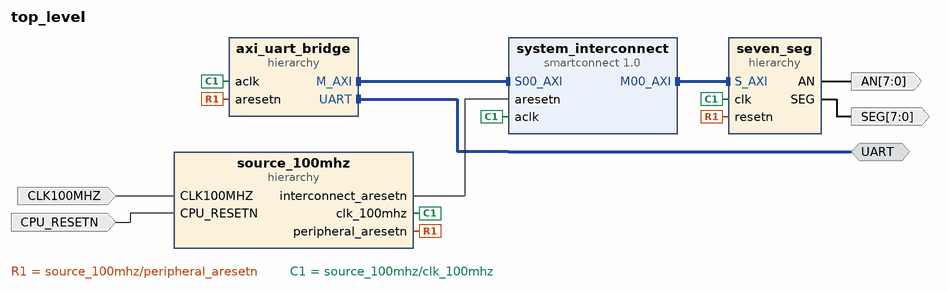
[diagram p0: block diagram of the top level]
# Vivado block design top_level, xc7a100tcsg324-1, Vivado 2021.1
create_bd_design top_level

create_bd_intf_port -mode Master -vlnv xilinx.com:interface:uart_rtl:1.0 UART
create_bd_port -dir I -type clk CLK100MHZ
set_property -dict {CONFIG.ASSOCIATED_RESET CPU_RESETN} [get_bd_ports CLK100MHZ]
create_bd_port -dir I -type rst CPU_RESETN
create_bd_port -dir O -from 7 -to 0 SEG
create_bd_port -dir O -from 7 -to 0 AN

create_bd_cell -type hier source_100mhz
create_bd_cell -type hier axi_uart_bridge
create_bd_cell -type hier seven_seg
create_bd_cell -type ip -vlnv xilinx.com:ip:smartconnect:1.0 system_interconnect
set_property -dict {CONFIG.NUM_SI 1} [get_bd_cells system_interconnect]

# ---- hierarchy /source_100mhz ----
current_bd_instance /source_100mhz
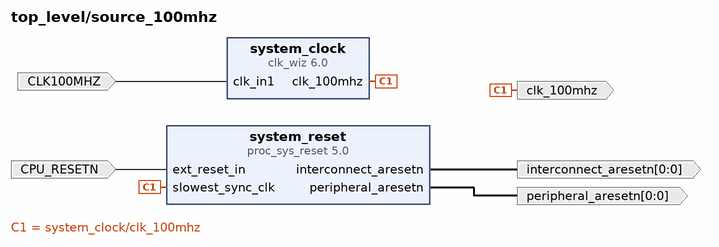
[diagram p1: block diagram inside /source_100mhz]
create_bd_pin -dir I -type clk CLK100MHZ
create_bd_pin -dir O -type clk clk_100mhz
create_bd_pin -dir I -type rst CPU_RESETN
create_bd_pin -dir O -from 0 -to 0 -type rst interconnect_aresetn
create_bd_pin -dir O -from 0 -to 0 -type rst peripheral_aresetn

create_bd_cell -type ip -vlnv xilinx.com:ip:clk_wiz:6.0 system_clock
set_property -dict [list \
  CONFIG.CLKOUT1_DRIVES BUFGCE \
  CONFIG.CLKOUT2_DRIVES BUFGCE \
  CONFIG.CLKOUT3_DRIVES BUFGCE \
  CONFIG.CLKOUT4_DRIVES BUFGCE \
  CONFIG.CLKOUT5_DRIVES BUFGCE \
  CONFIG.CLKOUT6_DRIVES BUFGCE \
  CONFIG.CLKOUT7_DRIVES BUFGCE \
  CONFIG.CLK_OUT1_PORT clk_100mhz \
  CONFIG.FEEDBACK_SOURCE FDBK_AUTO \
  CONFIG.USE_LOCKED false \
  CONFIG.USE_RESET false \
  CONFIG.USE_SAFE_CLOCK_STARTUP true \
] [get_bd_cells system_clock]
create_bd_cell -type ip -vlnv xilinx.com:ip:proc_sys_reset:5.0 system_reset

# ---- hierarchy /axi_uart_bridge ----
current_bd_instance /axi_uart_bridge
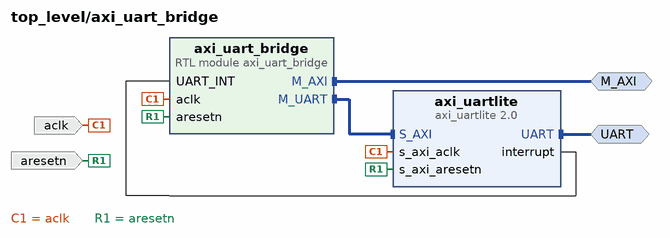
[diagram p2: block diagram inside /axi_uart_bridge]
create_bd_intf_pin -mode Master -vlnv xilinx.com:interface:aximm_rtl:1.0 M_AXI
create_bd_intf_pin -mode Master -vlnv xilinx.com:interface:uart_rtl:1.0 UART
create_bd_pin -dir I -type rst aresetn
create_bd_pin -dir I -type clk aclk

create_bd_cell -type module -reference axi_uart_bridge axi_uart_bridge
create_bd_cell -type ip -vlnv xilinx.com:ip:axi_uartlite:2.0 axi_uartlite
set_property -dict {CONFIG.C_BAUDRATE 115200} [get_bd_cells axi_uartlite]

# ---- hierarchy /seven_seg ----
current_bd_instance /seven_seg
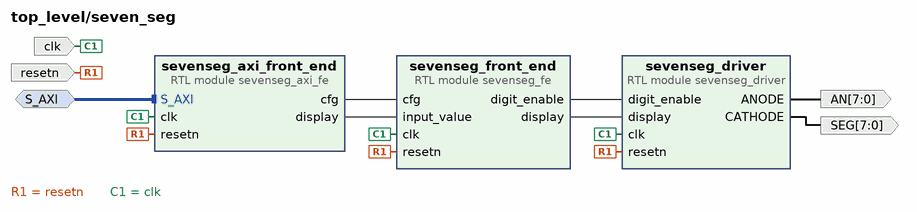
[diagram p3: block diagram inside /seven_seg]
create_bd_intf_pin -mode Slave -vlnv xilinx.com:interface:aximm_rtl:1.0 S_AXI
create_bd_pin -dir I -type clk clk
create_bd_pin -dir I -type rst resetn
create_bd_pin -dir O -from 7 -to 0 SEG
create_bd_pin -dir O -from 7 -to 0 AN

create_bd_cell -type module -reference sevenseg_driver sevenseg_driver
create_bd_cell -type module -reference sevenseg_axi_fe sevenseg_axi_front_end
create_bd_cell -type module -reference sevenseg_fe sevenseg_front_end

# ---- connections ----

current_bd_instance /source_100mhz
connect_bd_net [get_bd_pins CLK100MHZ] [get_bd_pins system_clock/clk_in1]
connect_bd_net [get_bd_pins CPU_RESETN] [get_bd_pins system_reset/ext_reset_in]
connect_bd_net [get_bd_pins system_clock/clk_100mhz] [get_bd_pins clk_100mhz] [get_bd_pins system_reset/slowest_sync_clk]
connect_bd_net [get_bd_pins system_reset/interconnect_aresetn] [get_bd_pins interconnect_aresetn]
connect_bd_net [get_bd_pins system_reset/peripheral_aresetn] [get_bd_pins peripheral_aresetn]

current_bd_instance /axi_uart_bridge
connect_bd_intf_net [get_bd_intf_pins M_AXI] [get_bd_intf_pins axi_uart_bridge/M_AXI]
connect_bd_intf_net [get_bd_intf_pins UART] [get_bd_intf_pins axi_uartlite/UART]
connect_bd_intf_net [get_bd_intf_pins axi_uart_bridge/M_UART] [get_bd_intf_pins axi_uartlite/S_AXI]
connect_bd_net [get_bd_pins aclk] [get_bd_pins axi_uart_bridge/aclk] [get_bd_pins axi_uartlite/s_axi_aclk]
connect_bd_net [get_bd_pins aresetn] [get_bd_pins axi_uart_bridge/aresetn] [get_bd_pins axi_uartlite/s_axi_aresetn]
connect_bd_net [get_bd_pins axi_uartlite/interrupt] [get_bd_pins axi_uart_bridge/UART_INT]

current_bd_instance /seven_seg
connect_bd_intf_net -intf_net system_interconnect_M00_AXI [get_bd_intf_pins S_AXI] [get_bd_intf_pins sevenseg_axi_front_end/S_AXI]
connect_bd_net [get_bd_pins sevenseg_axi_front_end/cfg] [get_bd_pins sevenseg_front_end/cfg]
connect_bd_net [get_bd_pins sevenseg_axi_front_end/display] [get_bd_pins sevenseg_front_end/input_value]
connect_bd_net [get_bd_pins sevenseg_driver/ANODE] [get_bd_pins AN]
connect_bd_net [get_bd_pins sevenseg_driver/CATHODE] [get_bd_pins SEG]
connect_bd_net [get_bd_pins sevenseg_front_end/digit_enable] [get_bd_pins sevenseg_driver/digit_enable]
connect_bd_net [get_bd_pins sevenseg_front_end/display] [get_bd_pins sevenseg_driver/display]
connect_bd_net -net source_100mhz_peripheral_aresetn [get_bd_pins resetn] \
  [get_bd_pins sevenseg_driver/resetn] [get_bd_pins sevenseg_axi_front_end/resetn] [get_bd_pins sevenseg_front_end/resetn]
connect_bd_net -net system_clock_clk_100mhz [get_bd_pins clk] \
  [get_bd_pins sevenseg_driver/clk] [get_bd_pins sevenseg_axi_front_end/clk] [get_bd_pins sevenseg_front_end/clk]

current_bd_instance /
connect_bd_intf_net -intf_net hier_0_M_AXI [get_bd_intf_pins system_interconnect/S00_AXI] [get_bd_intf_pins axi_uart_bridge/M_AXI]
connect_bd_intf_net -intf_net hier_0_UART [get_bd_intf_ports UART] [get_bd_intf_pins axi_uart_bridge/UART]
connect_bd_intf_net [get_bd_intf_pins seven_seg/S_AXI] [get_bd_intf_pins system_interconnect/M00_AXI]
connect_bd_net [get_bd_ports CLK100MHZ] [get_bd_pins source_100mhz/CLK100MHZ]
connect_bd_net [get_bd_ports CPU_RESETN] [get_bd_pins source_100mhz/CPU_RESETN]
connect_bd_net -net hier_0_AN [get_bd_pins seven_seg/AN] [get_bd_ports AN]
connect_bd_net -net hier_0_SEG [get_bd_pins seven_seg/SEG] [get_bd_ports SEG]
connect_bd_net [get_bd_pins source_100mhz/interconnect_aresetn] [get_bd_pins system_interconnect/aresetn]
connect_bd_net [get_bd_pins source_100mhz/peripheral_aresetn] [get_bd_pins axi_uart_bridge/aresetn] [get_bd_pins seven_seg/resetn]
connect_bd_net -net system_clock_clk_100mhz [get_bd_pins source_100mhz/clk_100mhz] \
  [get_bd_pins axi_uart_bridge/aclk] [get_bd_pins seven_seg/clk] [get_bd_pins system_interconnect/aclk]

# ---- address map ----
assign_bd_address -offset 0x0000000000001000 -range 128 -target_address_space [get_bd_addr_spaces axi_uart_bridge/axi_uart_bridge/M_AXI] [get_bd_addr_segs seven_seg/sevenseg_axi_front_end/S_AXI/reg0]
assign_bd_address -offset 0x40600000 -range 64K -target_address_space [get_bd_addr_spaces axi_uart_bridge/axi_uart_bridge/M_UART] [get_bd_addr_segs axi_uart_bridge/axi_uartlite/S_AXI/Reg]

validate_bd_design
save_bd_design
